# Altium schematic sheet Audio_ADC.SchDoc
size Letter
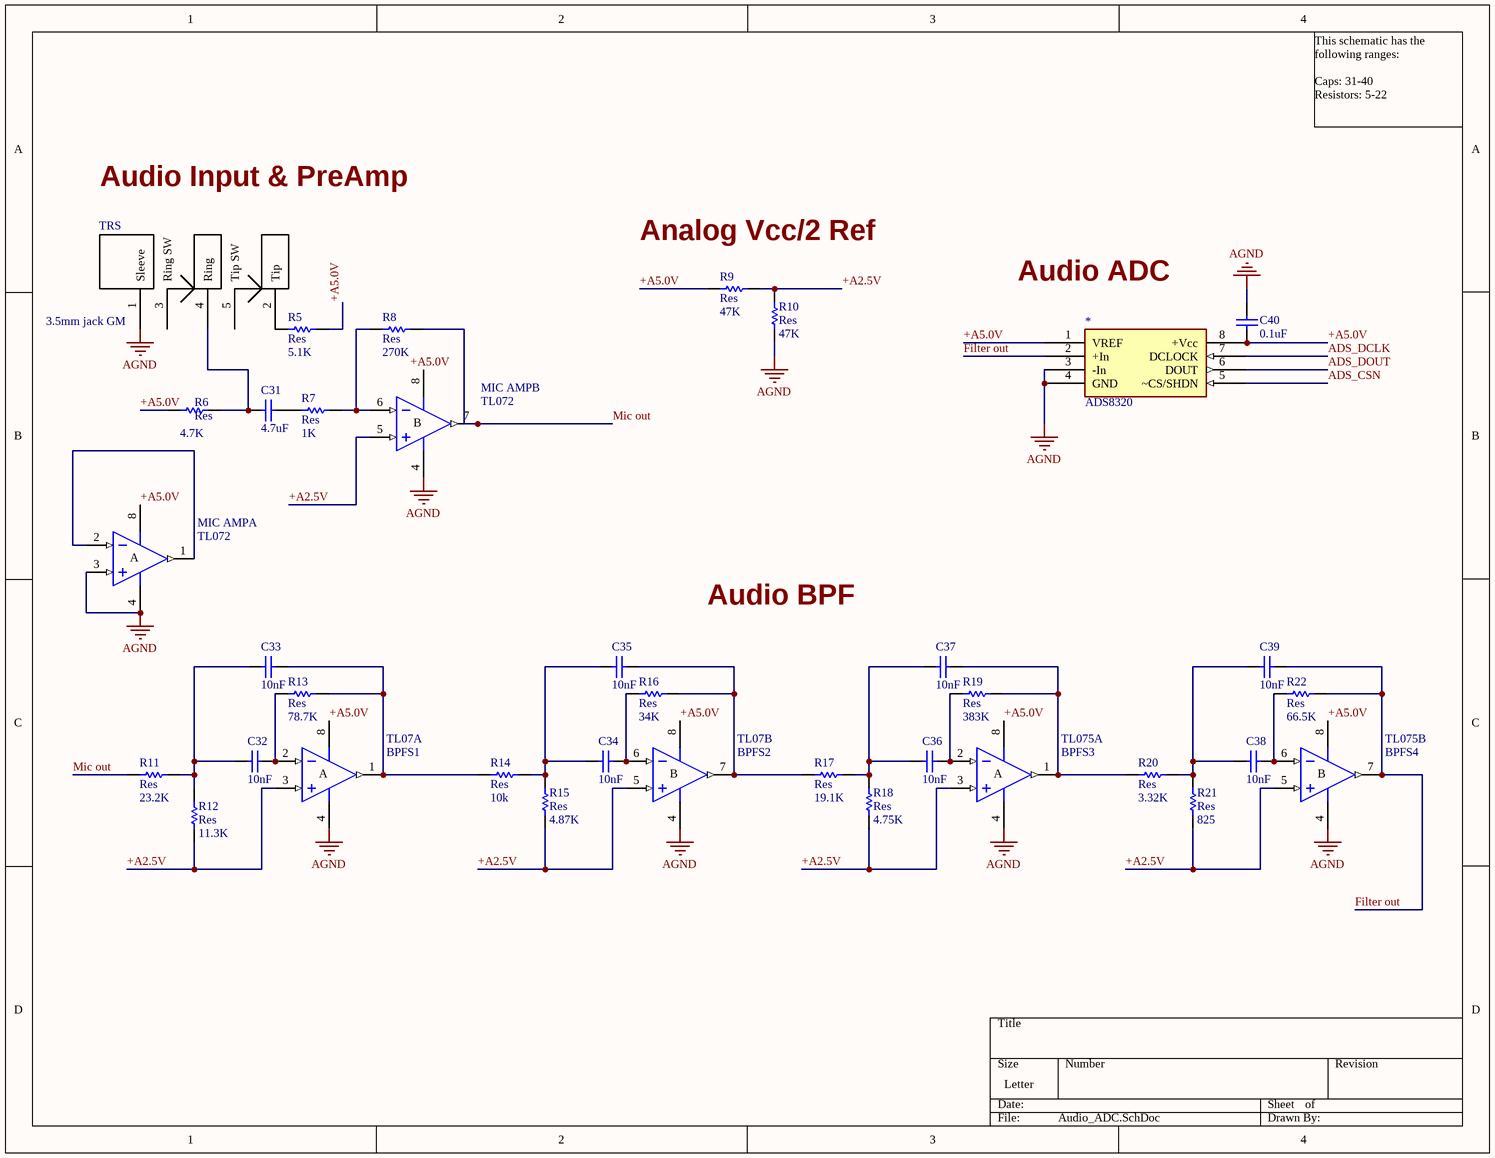
[diagram p0: Audio_ADC.SchDoc]

## Parts
*  ADS8320  [TSOP65P490X110-8N]
C31  value 4.7uF  [0805]  (hidden comment: Cap Semi)
C32  value 10nF  [0805]  (hidden comment: Cap Semi)
C33  value 10nF  [0805]  (hidden comment: Cap Semi)
C34  value 10nF  [0805]  (hidden comment: Cap Semi)
C35  value 10nF  [0805]  (hidden comment: Cap Semi)
C36  value 10nF  [0805]  (hidden comment: Cap Semi)
C37  value 10nF  [0805]  (hidden comment: Cap Semi)
C38  value 10nF  [0805]  (hidden comment: Cap Semi)
C39  value 10nF  [0805]  (hidden comment: Cap Semi)
C40  value 0.1uF  [0805]  (hidden comment: Cap Semi)
MIC_AMP  TL072  [DIP-8]  (parts A,B of 2)
R5  Res  value 5.1K  [0805]
R6  Res  value 4.7K  [0805]
R7  Res  value 1K  [0805]
R8  Res  value 270K  [0805]
R9  Res  value 47K  [0805]
R10  Res  value 47K  [0805]
R11  Res  value 23.2K  [0805]
R12  Res  value 11.3K  [0805]
R13  Res  value 78.7K  [0805]
R14  Res  value 10k  [0805]
R15  Res  value 4.87K  [0805]
R16  Res  value 34K  [0805]
R17  Res  value 19.1K  [0805]
R18  Res  value 4.75K  [0805]
R19  Res  value 383K  [0805]
R20  Res  value 3.32K  [0805]
R21  Res  value 825  [0805]
R22  Res  value 66.5K  [0805]
TL07  BPFS1  [DIP-8]  (parts A,B of 2)
TL075  BPFS3  [DIP-8]  (parts A,B of 2)
TRS  3.5mm jack GM  [3.5mm jack GM]

## Nets
AGND: *.3(-In) *.4(GND) C40.2 MIC_AMP.3(IN+) MIC_AMP.4(V-) R10.1 TL07.4(V-) TL075.4(V-) TRS.1(Sleeve)
+A2.5V: MIC_AMP.5(IN+) R9.1 R10.2 R12.2 R15.1 R18.1 R21.1 TL07.3(IN+) TL07.5(IN+) TL075.3(IN+) TL075.5(IN+)
+A5.0V: *.1(VREF) *.8(+Vcc) C40.1 MIC_AMP.8(V+) R5.1 R6.2 R9.2 TL07.8(V+) TL075.8(V+)
ADS_CSN: *.5(~CS/SHDN)
ADS_DCLK: *.7(DCLOCK)
ADS_DOUT: *.6(DOUT)
Filter out: *.2(+In) C39.2 R22.1 TL075.7(OUT)
Mic out: MIC_AMP.7(OUT) R8.1 R11.2
NetC31_1: C31.1 R6.1 TRS.4(Ring)
NetC31_2: C31.2 R7.2
NetC32_1: C32.1 C33.1 R11.1 R12.1
NetC32_2: C32.2 R13.2 TL07.2(IN-)
NetC33_2: C33.2 R13.1 R14.2 TL07.1(OUT)
NetC34_1: C34.1 C35.1 R14.1 R15.2
NetC34_2: C34.2 R16.2 TL07.6(IN-)
NetC35_2: C35.2 R16.1 R17.2 TL07.7(OUT)
NetC36_1: C36.1 C37.1 R17.1 R18.2
NetC36_2: C36.2 R19.2 TL075.2(IN-)
NetC37_2: C37.2 R19.1 R20.2 TL075.1(OUT)
NetC38_1: C38.1 C39.1 R20.1 R21.2
NetC38_2: C38.2 R22.2 TL075.6(IN-)
NetMIC_AMP_1: MIC_AMP.1(OUT) MIC_AMP.2(IN-)
NetMIC_AMP_6: MIC_AMP.6(IN-) R7.1 R8.2
NetR5_2: R5.2 TRS.2(Tip)

Not connected (* = marked no-connect by the designer): TRS 3(Ring_SW) 5(Tip_SW)

## Notes on the sheet
- This schematic has the following ranges:
  Caps: 31-40
  Resistors: 5-22
- Audio Input & PreAmp
- Analog Vcc/2 Ref
- Audio ADC
- Audio BPF
- Labels drawn without touching a wire or pin: +A5.0V
- (in symbol LT1632CN8, part A) A
- (in symbol LT1632CN8, part B) B

## Library data of the parts
C31-C40 = Cap Semi: Capacitor (Semiconductor SIM Model); Published: 8-Jun-2000; LatestRevisionDate: 17-Jul-2002; LatestRevisionNote: Re-released for DXP Platform.; PackageReference: C1206; Publisher: Altium Limited
MIC_AMP TL07 TL075 = LT1632CN8: 45MHz, 45V/µs, Dual Rail-to-Rail Input and Output Precision Operational Amplifier; Note: 1455; Published: 8-Jun-2000; LatestRevisionDate: 29-May-2009; LatestRevisionNote: Component Body Added.; DatasheetVersion: 1996; PackageVersion: N8 1002; PackageReference: N8; Publisher: Altium Limited; PackageDescription: DIP, Plastic, 8-Pin, Row Spacing 7.62 mm, Pitch 2.54 mm; ComponentLink1Description: Manufacturer Link; ComponentLink1URL: http://www.linear.com/; ComponentLink2Description: Datasheet; ComponentLink2URL: http://www.linear.com/pc/downloadDocument.do?navId=H0,C1,C1154,C1009,C1022,P1642,D3055
R5-R22 = Res Semi: Semiconductor Resistor; Published: 8-Jun-2000; LatestRevisionDate: 17-Jul-2002; LatestRevisionNote: Re-released for DXP Platform.; PackageReference: AXIAL-0.5; Publisher: Altium Limited